# Altium schematic sheet Scheet_MCUBOOT_esp32s3.SchDoc
size A4; SheetNumber: 7; SheetTotal: 7
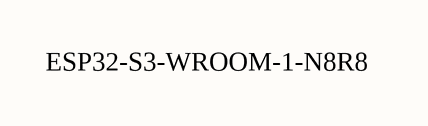
[diagram p0: Scheet_MCUBOOT_esp32s3.SchDoc]

## Notes on the sheet
- ESP32-S3-WROOM-1-N8R8